# Altium schematic sheet MOSFETs and Driver.SchDoc
size B
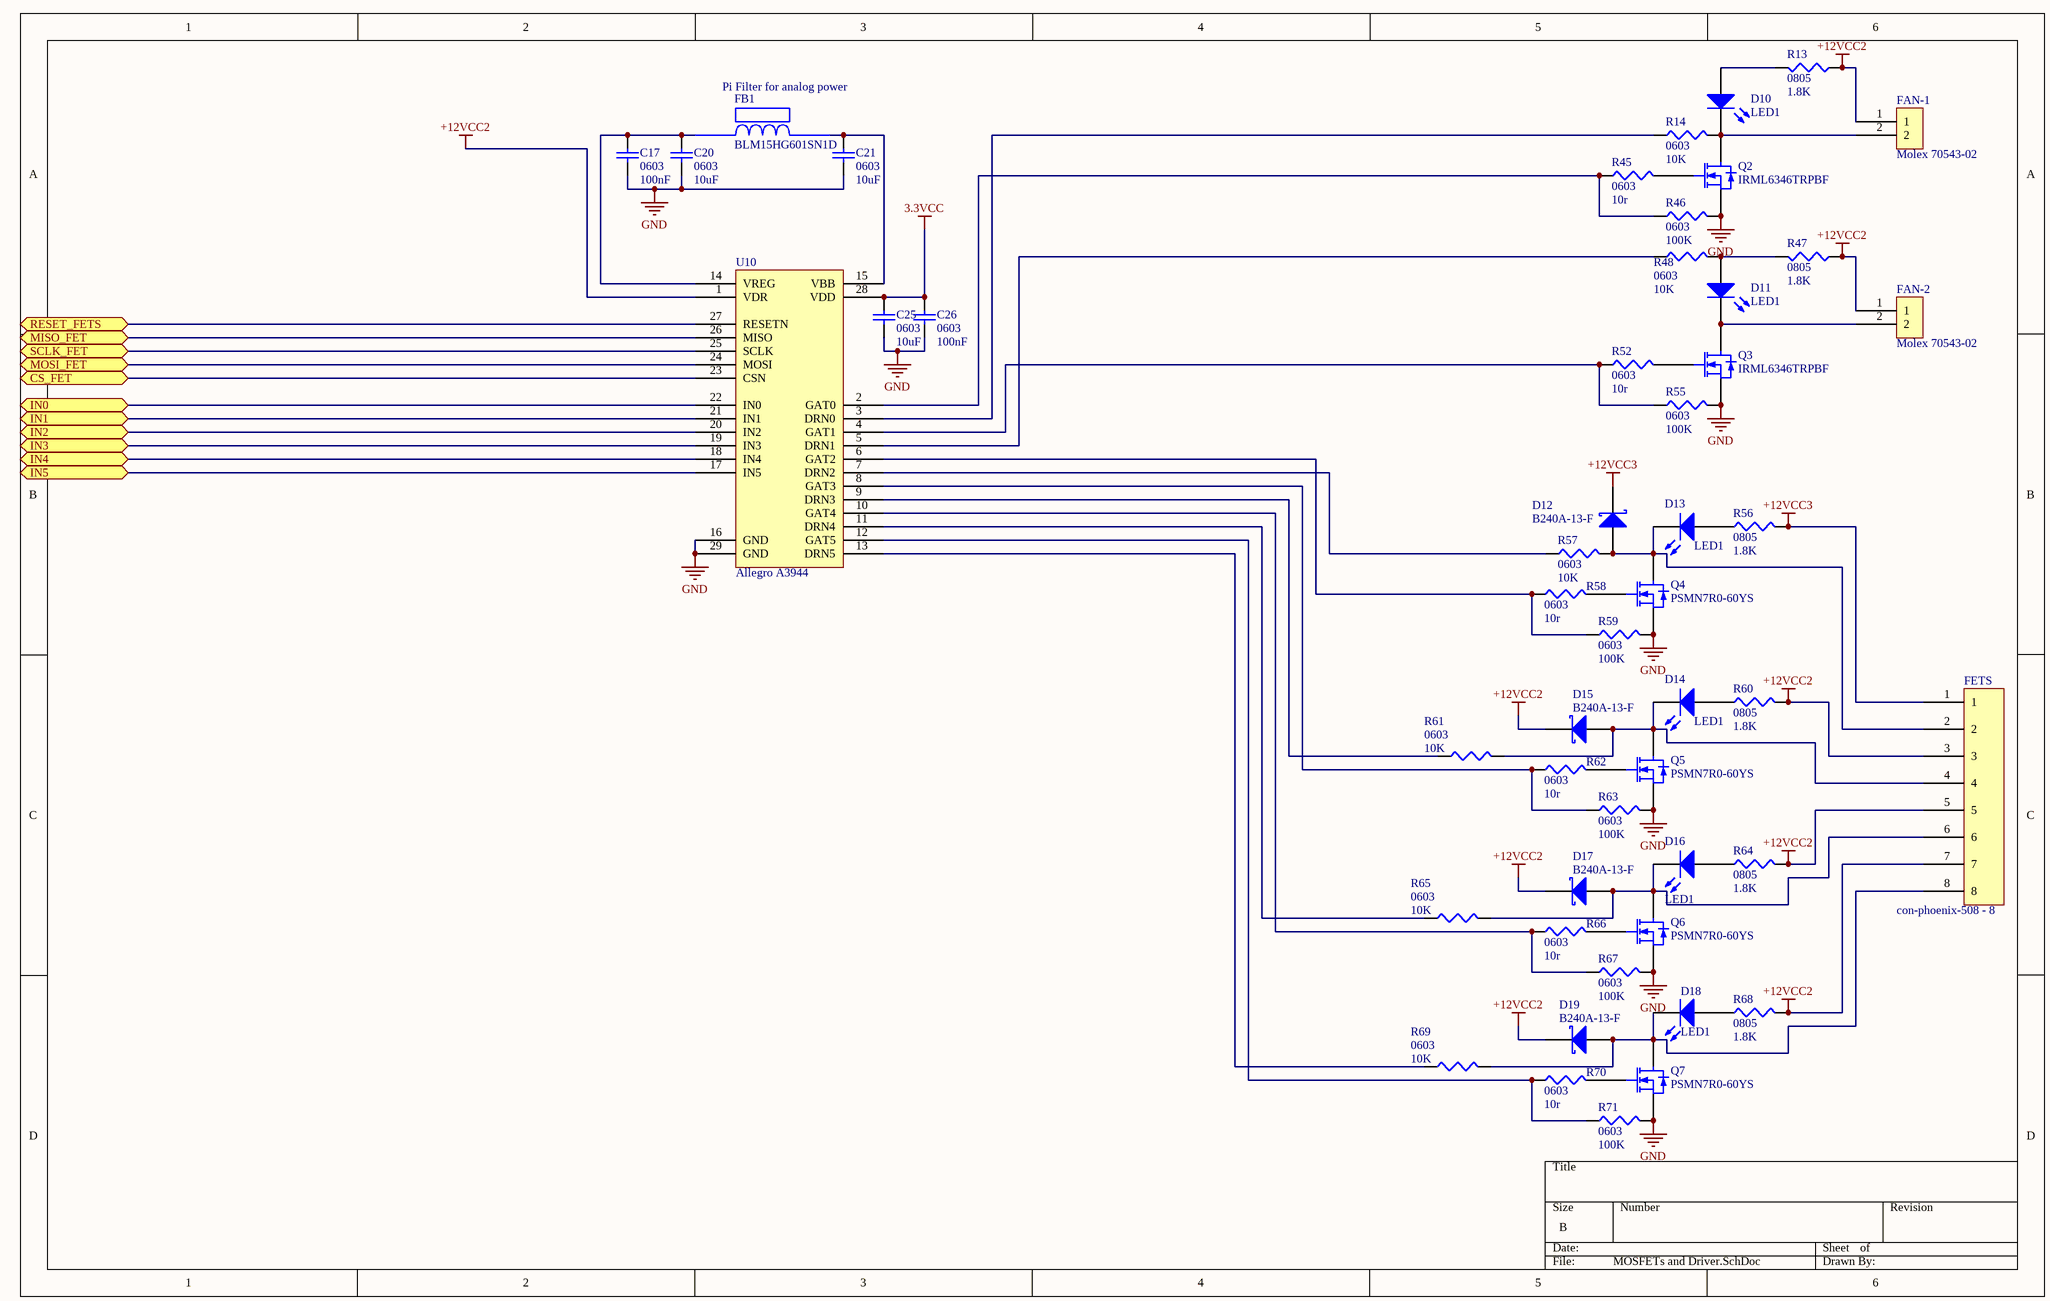
[diagram p0: MOSFETs and Driver.SchDoc]

## Parts
C17  0603  value 100nF  [1608[0603]]
C20  0603  value 10uF  [1608[0603]]
C21  0603  value 10uF  [1608[0603]]
C25  0603  value 10uF  [1608[0603]]
C26  0603  value 100nF  [1608[0603]]
D10  LED1  [SM 0805 polarized]
D11  LED1  [SM 0805 polarized]
D12  B240A-13-F  [SK310A-TP]
D13  LED1  [SM 0805 polarized]
D14  LED1  [SM 0805 polarized]
D15  B240A-13-F  [SK310A-TP]
D16  LED1  [SM 0805 polarized]
D17  B240A-13-F  [SK310A-TP]
D18  LED1  [SM 0805 polarized]
D19  B240A-13-F  [SK310A-TP]
FAN-1  Molex 70543-02  [70543-02]
FAN-2  Molex 70543-02  [70543-02]
FB1  BLM15HG601SN1D  [BLM18PG121SN1D]
FETS  con-phoenix-508 - 8  [MSTBV4]
Q2  IRML6346TRPBF  [IRLML6346]
Q3  IRML6346TRPBF  [IRLML6346]
Q4  PSMN7R0-60YS  [PSMN7R0-60YS]
Q5  PSMN7R0-60YS  [PSMN7R0-60YS]
Q6  PSMN7R0-60YS  [PSMN7R0-60YS]
Q7  PSMN7R0-60YS  [PSMN7R0-60YS]
R13  0805  value 1.8K  [SM 0805 - gap trimmed]
R14  0603  value 10K  [J1-0603]
R45  0603  value 10r  [J1-0603]
R46  0603  value 100K  [J1-0603]
R47  0805  value 1.8K  [SM 0805 - gap trimmed]
R48  0603  value 10K  [J1-0603]
R52  0603  value 10r  [J1-0603]
R55  0603  value 100K  [J1-0603]
R56  0805  value 1.8K  [SM 0805 - gap trimmed]
R57  0603  value 10K  [J1-0603]
R58  0603  value 10r  [J1-0603]
R59  0603  value 100K  [J1-0603]
R60  0805  value 1.8K  [SM 0805 - gap trimmed]
R61  0603  value 10K  [J1-0603]
R62  0603  value 10r  [J1-0603]
R63  0603  value 100K  [J1-0603]
R64  0805  value 1.8K  [SM 0805 - gap trimmed]
R65  0603  value 10K  [J1-0603]
R66  0603  value 10r  [J1-0603]
R67  0603  value 100K  [J1-0603]
R68  0805  value 1.8K  [SM 0805 - gap trimmed]
R69  0603  value 10K  [J1-0603]
R70  0603  value 10r  [J1-0603]
R71  0603  value 100K  [J1-0603]
U10  Allegro A3944  [A3944 28 Pin TSSOP]

## Ports
CS_FET, IN0, IN1, IN2, IN3, IN4, IN5, MISO_FET, MOSI_FET, RESET_FETS, SCLK_FET

## Nets
3.3VCC: C25.2 C26.1 U10.28(VDD)
+12VCC2: D15.2(K) D17.2(K) D19.2(K) FAN-1.1 FAN-2.1 FETS.3 FETS.5 FETS.7 R13.1 R47.1 R60.2 R64.2 R68.2 U10.1(VDR)
+12VCC3: D12.2(K) FETS.1 R56.2
GND: C17.2 C20.1 C21.1 C25.1 C26.2 Q2.2(S) Q3.2(S) Q4.1(S) Q4.2(S) Q4.3(S) Q5.1(S) Q5.2(S) Q5.3(S) Q6.1(S) Q6.2(S) Q6.3(S) Q7.1(S) Q7.2(S) Q7.3(S) R46.2 R55.2 R59.2 R63.2 R67.2 R71.2 U10.16(GND) U10.29(GND)
CS_FET: U10.23(CSN) ; port CS_FET
IN0: U10.22(IN0) ; port IN0
IN1: U10.21(IN1) ; port IN1
IN2: U10.20(IN2) ; port IN2
IN3: U10.19(IN3) ; port IN3
IN4: U10.18(IN4) ; port IN4
IN5: U10.17(IN5) ; port IN5
MISO_FET: U10.26(MISO) ; port MISO_FET
MOSI_FET: U10.24(MOSI) ; port MOSI_FET
RESET_FETS: U10.27(RESETN) ; port RESET_FETS
SCLK_FET: U10.25(SCLK) ; port SCLK_FET
NetC17_1: C17.1 C20.2 FB1.1 U10.14(VREG)
NetC21_2: C21.2 FB1.2 U10.15(VBB)
NetD10_1: D10.1(A) FAN-1.2 Q2.3(D) R14.2
NetD10_2: D10.2(K) R13.2
NetD11_1: D11.1(A) FAN-2.2 Q3.3(D)
NetD11_2: D11.2(K) R47.2 R48.2
NetD12_1: D12.1(A) D13.1(A) FETS.2 Q4.5(D) R57.2
NetD13_2: D13.2(K) R56.1
NetD14_1: D14.1(A) D15.1(A) FETS.4 Q5.5(D) R61.2
NetD14_2: D14.2(K) R60.1
NetD16_1: D16.1(A) D17.1(A) FETS.6 Q6.5(D) R65.2
NetD16_2: D16.2(K) R64.1
NetD18_1: D18.1(A) D19.1(A) FETS.8 Q7.5(D) R69.2
NetD18_2: D18.2(K) R68.1
NetQ2_1: Q2.1(G) R45.2
NetQ3_1: Q3.1(G) R52.2
NetQ4_4: Q4.4(G) R58.2
NetQ5_4: Q5.4(G) R62.2
NetQ6_4: Q6.4(G) R66.2
NetQ7_4: Q7.4(G) R70.2
NetR14_1: R14.1 U10.3(DRN0)
NetR45_1: R45.1 R46.1 U10.2(GAT0)
NetR48_1: R48.1 U10.5(DRN1)
NetR52_1: R52.1 R55.1 U10.4(GAT1)
NetR57_1: R57.1 U10.7(DRN2)
NetR58_1: R58.1 R59.1 U10.6(GAT2)
NetR61_1: R61.1 U10.9(DRN3)
NetR62_1: R62.1 R63.1 U10.8(GAT3)
NetR65_1: R65.1 U10.11(DRN4)
NetR66_1: R66.1 R67.1 U10.10(GAT4)
NetR69_1: R69.1 U10.13(DRN5)
NetR70_1: R70.1 R71.1 U10.12(GAT5)

## Notes on the sheet
- Pi Filter for analog power

## Library data of the parts
C17 C20 C21 C25 C26 = Cap Semi: Capacitor (Semiconductor SIM Model); Published: 8-Jun-2000; LatestRevisionDate: 29-May-2009; LatestRevisionNote: IPC-7351 Footprint Added.; PackageReference: C1206; Publisher: Altium Limited; PackageDescription: Chip Capacitor
D10 D11 D13 D14 D16 D18 = LED1: Typical RED GaAs LED; Published: 8-Jun-2000; LatestRevisionDate: 08-Jul-2005; LatestRevisionNote: Mech Layer 1 removed.; PackageReference: LED-1; Publisher: Altium Limited; PackageDescription: LED; 2 Leads
D12 D15 D17 D19 = D Schottky: Schottky Diode; Published: 8-Jun-2000; LatestRevisionDate: 17-Jul-2002; LatestRevisionNote: Re-released for DXP Platform.; PackageReference: SMB; Publisher: Altium Limited; PackageDescription: DO-214-AA/SMB; 2 C-Bend Leads; Body 5.3 x 3.6 mm, inc. leads (LxW); Code_JEDEC: DO-214-AA
FETS = con-phoenix-508
Q2 Q3 = IRML6346TRPBF: N-Channel MOSFET; Published: 8-Jun-2000; LatestRevisionDate: 17-Jul-2002; LatestRevisionNote: Re-released for DXP Platform.; PackageVersion: 1995/1996; PackageReference: E3; Publisher: Altium Limited; PackageDescription: TO, Flat Index; 3 In-Line, Axial Leads; Body Dia. 4.6mm; Lead Dia. 0.5 mm (max)
Q4-Q7 = PSMN7R0-60YS: N-Channel MOSFET; Published: 8-Jun-2000; LatestRevisionDate: 17-Jul-2002; LatestRevisionNote: Re-released for DXP Platform.; PackageVersion: 1995/1996; PackageReference: E3; Publisher: Altium Limited; PackageDescription: TO, Flat Index; 3 In-Line, Axial Leads; Body Dia. 4.6mm; Lead Dia. 0.5 mm (max)
R13 R14 R45-R48 R52 R55-R71 = Res3: Resistor; Published: 8-Jun-2000; LatestRevisionDate: 29-May-2009; LatestRevisionNote: IPC-7351 Footprint Added.; PackageReference: J1-0603; Publisher: Altium Limited; PackageDescription: Chip Resistor
U10 = A3944 - MOSFET Low Side Driver: Allegro Micro A3944 MOST Driver (low side)